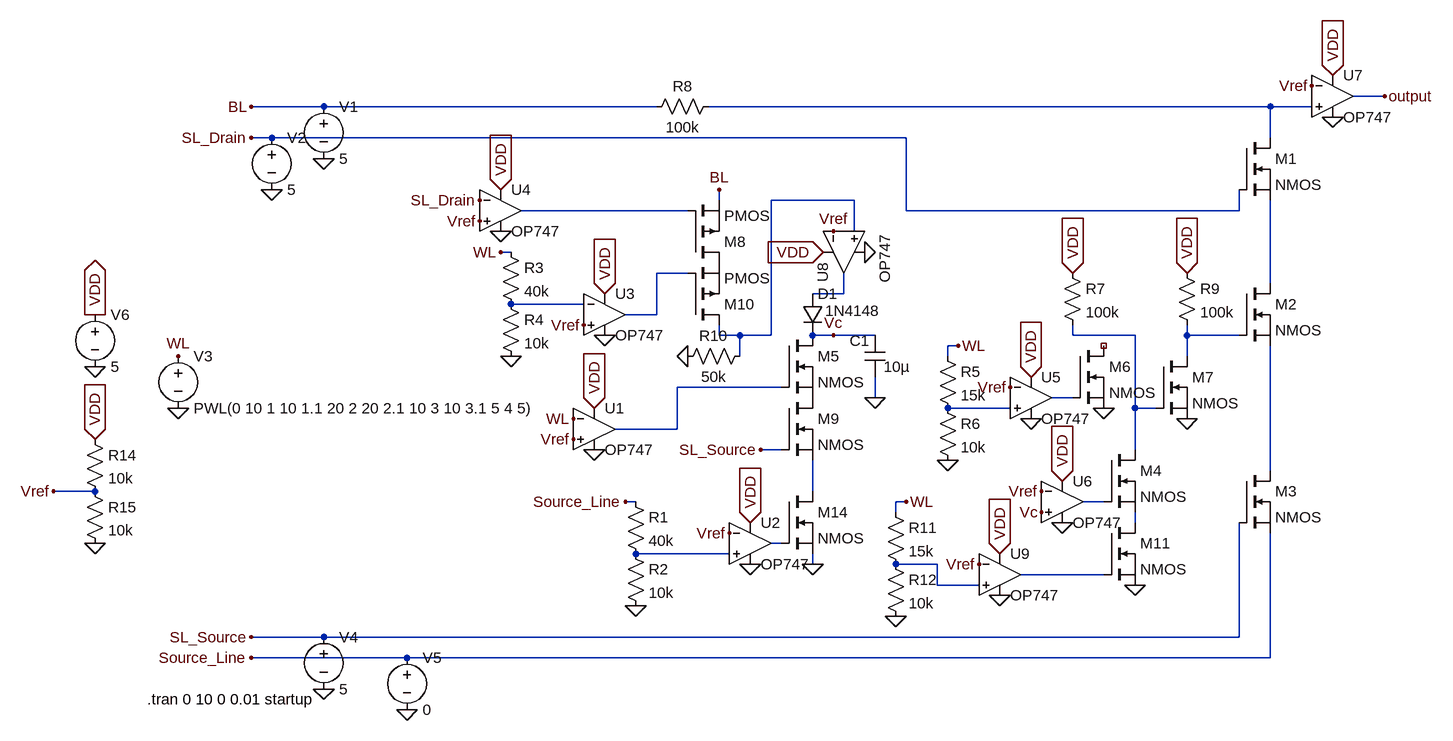
[diagram p0: schematic nand_test.asc]
nand_test.asc, the LTspice schematic file:
Version 4
SHEET 1 1904 1092
WIRE 1680 128 1632 128
WIRE 48 144 -64 144
WIRE 560 144 48 144
WIRE 1504 144 640 144
WIRE 1568 144 1504 144
WIRE -32 192 -64 192
WIRE 944 192 -32 192
WIRE 1504 192 1504 144
WIRE 656 288 656 272
WIRE 864 288 736 288
WIRE 608 304 352 304
WIRE 944 304 944 192
WIRE 1456 304 1456 272
WIRE 1456 304 944 304
WIRE 864 336 864 288
WIRE 336 368 320 368
WIRE 608 400 560 400
WIRE 1504 416 1504 288
WIRE 848 432 848 400
WIRE 848 432 800 432
WIRE 448 448 336 448
WIRE 560 464 560 400
WIRE 560 464 512 464
WIRE 656 496 656 480
WIRE 688 496 656 496
WIRE 736 496 736 288
WIRE 736 496 688 496
WIRE 832 496 800 496
WIRE 896 496 832 496
WIRE 1200 496 1200 480
WIRE 1296 496 1200 496
WIRE 1376 496 1376 480
WIRE 1456 496 1376 496
WIRE 1024 512 1008 512
WIRE 688 528 688 496
WIRE 1008 528 1008 512
WIRE 1376 528 1376 496
WIRE 752 576 592 576
WIRE 896 592 896 560
WIRE 1200 592 1168 592
WIRE 1104 608 1008 608
WIRE 1296 608 1296 496
WIRE 1328 608 1296 608
WIRE 592 640 592 576
WIRE 592 640 496 640
WIRE 752 672 720 672
WIRE 1296 672 1296 608
WIRE 1504 704 1504 512
WIRE -304 736 -368 736
WIRE 800 736 800 688
WIRE 528 752 512 752
WIRE 944 752 928 752
WIRE 1248 752 1216 752
WIRE 928 768 928 752
WIRE 1296 784 1296 768
WIRE 752 816 736 816
WIRE 672 832 528 832
WIRE 800 848 800 832
WIRE 992 848 928 848
WIRE 1248 864 1120 864
WIRE 992 880 992 848
WIRE 1056 880 992 880
WIRE 48 960 -64 960
WIRE 1456 960 1456 784
WIRE 1456 960 48 960
WIRE 176 992 -64 992
WIRE 1504 992 1504 800
WIRE 1504 992 176 992
FLAG 896 592 0
FLAG -64 144 BL
FLAG -176 528 WL
FLAG -64 192 SL_Drain
FLAG -64 960 SL_Source
FLAG -64 992 Source_Line
FLAG 48 224 0
FLAG -32 272 0
FLAG -176 608 0
FLAG 48 1040 0
FLAG 176 1072 0
FLAG -304 544 0
FLAG -304 464 VDD
IOPIN -304 464 Out
FLAG 1680 128 output
FLAG 832 496 Vc
FLAG 800 848 0
FLAG -304 816 0
FLAG -304 656 VDD
IOPIN -304 656 In
FLAG -368 736 Vref
FLAG 704 784 VDD
IOPIN 704 784 In
FLAG 704 848 0
FLAG 464 672 0
FLAG 480 432 VDD
IOPIN 480 432 In
FLAG 480 496 0
FLAG 720 672 SL_Source
FLAG 464 608 VDD
IOPIN 464 608 In
FLAG 320 272 VDD
IOPIN 320 272 In
FLAG 320 336 0
FLAG 288 320 Vref
FLAG 448 480 Vref
FLAG 672 800 Vref
FLAG 528 912 0
FLAG 512 752 Source_Line
FLAG 432 656 Vref
FLAG 432 624 WL
FLAG 336 528 0
FLAG 320 368 WL
FLAG 1136 560 VDD
IOPIN 1136 560 In
FLAG 1136 624 0
FLAG 1104 576 Vref
FLAG 1184 720 VDD
IOPIN 1184 720 In
FLAG 1184 784 0
FLAG 1152 736 Vref
FLAG 1152 768 Vc
FLAG 1008 688 0
FLAG 1024 512 WL
FLAG 1248 608 0
FLAG 1200 400 VDD
IOPIN 1200 400 In
FLAG 1376 400 VDD
IOPIN 1376 400 In
FLAG 1376 624 0
FLAG 1600 96 VDD
IOPIN 1600 96 In
FLAG 1600 160 0
FLAG 1568 112 Vref
FLAG 816 368 VDD
IOPIN 816 368 In
FLAG 880 368 0
FLAG 832 336 Vref
FLAG 608 528 0
FLAG 1296 880 0
FLAG 288 288 SL_Drain
FLAG 656 272 BL
FLAG 928 928 0
FLAG 944 752 WL
FLAG 1088 832 VDD
IOPIN 1088 832 In
FLAG 1088 896 0
FLAG 1056 848 Vref
SYMBOL nmos 1456 192 R0
SYMATTR InstName M1
SYMBOL nmos 1456 416 R0
SYMATTR InstName M2
SYMBOL cap 912 560 R180
WINDOW 0 24 56 Left 2
WINDOW 3 -38 16 Left 2
SYMATTR InstName C1
SYMATTR Value 10µ
SYMBOL nmos 1456 704 R0
SYMATTR InstName M3
SYMBOL nmos 752 496 R0
SYMATTR InstName M5
SYMBOL voltage 48 128 R0
WINDOW 123 0 0 Left 0
WINDOW 39 0 0 Left 0
SYMATTR InstName V1
SYMATTR Value 5
SYMBOL voltage -32 176 R0
WINDOW 123 0 0 Left 0
WINDOW 39 0 0 Left 0
SYMATTR InstName V2
SYMATTR Value 5
SYMBOL voltage -176 512 R0
WINDOW 123 0 0 Left 0
WINDOW 39 0 0 Left 0
SYMATTR InstName V3
SYMATTR Value PWL(0 10 1 10 1.1 20 2 20 2.1 10 3 10 3.1 5 4 5)
SYMBOL voltage 48 944 R0
WINDOW 123 0 0 Left 0
WINDOW 39 0 0 Left 0
SYMATTR InstName V4
SYMATTR Value 5
SYMBOL voltage 176 976 R0
WINDOW 123 0 0 Left 0
WINDOW 39 0 0 Left 0
SYMATTR InstName V5
SYMATTR Value 0
SYMBOL voltage -304 448 R0
WINDOW 123 0 0 Left 0
WINDOW 39 0 0 Left 0
SYMATTR InstName V6
SYMATTR Value 5
SYMBOL res 656 128 R90
WINDOW 0 0 56 VBottom 2
WINDOW 3 32 56 VTop 2
SYMATTR InstName R8
SYMATTR Value 100k
SYMBOL nmos 752 592 R0
SYMATTR InstName M9
SYMBOL nmos 752 736 R0
SYMATTR InstName M14
SYMBOL res -320 640 R0
SYMATTR InstName R14
SYMATTR Value 10k
SYMBOL res -320 720 R0
SYMATTR InstName R15
SYMATTR Value 10k
SYMBOL OpAmps\\OP747 464 576 R0
SYMATTR InstName U1
SYMBOL OpAmps\\OP747 704 752 R0
SYMATTR InstName U2
SYMBOL OpAmps\\OP747 480 400 R0
SYMATTR InstName U3
SYMBOL OpAmps\\OP747 320 240 R0
SYMATTR InstName U4
SYMBOL res 512 736 R0
SYMATTR InstName R1
SYMATTR Value 40k
SYMBOL res 512 816 R0
SYMATTR InstName R2
SYMATTR Value 10k
SYMBOL res 320 352 R0
SYMATTR InstName R3
SYMATTR Value 40k
SYMBOL res 320 432 R0
SYMATTR InstName R4
SYMATTR Value 10k
SYMBOL OpAmps\\OP747 1136 528 R0
SYMATTR InstName U5
SYMBOL OpAmps\\OP747 1184 688 R0
SYMATTR InstName U6
SYMBOL res 992 512 R0
SYMATTR InstName R5
SYMATTR Value 15k
SYMBOL res 992 592 R0
SYMATTR InstName R6
SYMATTR Value 10k
SYMBOL nmos 1248 672 R0
SYMATTR InstName M4
SYMBOL nmos 1200 512 R0
SYMATTR InstName M6
SYMBOL res 1184 384 R0
SYMATTR InstName R7
SYMATTR Value 100k
SYMBOL nmos 1328 528 R0
SYMATTR InstName M7
SYMBOL res 1360 384 R0
SYMATTR InstName R9
SYMATTR Value 100k
SYMBOL OpAmps\\OP747 1600 64 R0
SYMATTR InstName U7
SYMBOL pmos 608 384 M180
SYMATTR InstName M8
SYMBOL pmos 608 480 M180
SYMATTR InstName M10
SYMBOL OpAmps\\OP747 784 368 M90
WINDOW 3 -28 127 Left 2
SYMATTR InstName U8
SYMBOL res 704 512 R90
WINDOW 0 0 56 VBottom 2
WINDOW 3 32 56 VTop 2
SYMATTR InstName R10
SYMATTR Value 50k
SYMBOL diode 784 432 R0
WINDOW 3 35 26 Left 2
SYMATTR Value 1N4148
SYMATTR InstName D1
SYMBOL nmos 1248 784 R0
SYMATTR InstName M11
SYMBOL res 912 752 R0
SYMATTR InstName R11
SYMATTR Value 15k
SYMBOL res 912 832 R0
SYMATTR InstName R12
SYMATTR Value 10k
SYMBOL OpAmps\\OP747 1088 800 R0
SYMATTR InstName U9
TEXT -224 1056 Left 2 !.tran 0 10 0 0.01 startup

The netlist it stands for:
* nand_test.asc
M1 N001 SL_Drain N005 N005 NMOS
M2 N005 N009 N013 N013 NMOS
C1 0 Vc 10µ
M3 N013 SL_Source Source_Line Source_Line NMOS
M5 Vc N010 P001 P001 NMOS
V1 BL 0 5
V2 SL_Drain 0 5
V3 WL 0 PWL(0 10 1 10 1.1 20 2 20 2.1 10 3 10 3.1 5 4 5)
V4 SL_Source 0 5
V5 Source_Line 0 0
V6 VDD 0 5
R8 N001 BL 100k
M9 P001 SL_Source N014 N014 NMOS
M14 N014 N017 0 0 NMOS
R14 VDD Vref 10k
R15 Vref 0 10k
XU1 Vref WL VDD 0 N010 OP747  ; pins In+ In- V+ V- OUT
XU2 N018 Vref VDD 0 N017 OP747  ; pins In+ In- V+ V- OUT
XU3 Vref N007 VDD 0 N004 OP747  ; pins In+ In- V+ V- OUT
XU4 Vref SL_Drain VDD 0 N003 OP747  ; pins In+ In- V+ V- OUT
R1 Source_Line N018 40k
R2 N018 0 10k
R3 WL N007 40k
R4 N007 0 10k
XU5 N012 Vref VDD 0 N011 OP747  ; pins In+ In- V+ V- OUT
XU6 Vc Vref VDD 0 N015 OP747  ; pins In+ In- V+ V- OUT
R5 WL N012 15k
R6 N012 0 10k
M4 N008 N015 N016 N016 NMOS
M6 NC_01 N011 0 0 NMOS
R7 VDD N008 100k
M7 N009 N008 0 0 NMOS
R9 VDD N009 100k
XU7 N001 Vref VDD 0 output OP747  ; pins In+ In- V+ V- OUT
M8 P002 N003 BL BL PMOS
M10 N002 N004 P002 P002 PMOS
XU8 N002 Vref VDD 0 N006 OP747  ; pins In+ In- V+ V- OUT
R10 N002 0 50k
D1 N006 Vc 1N4148
M11 N016 N020 0 0 NMOS
R11 WL N019 15k
R12 N019 0 10k
XU9 N019 Vref VDD 0 N020 OP747  ; pins In+ In- V+ V- OUT
.model D D
.lib standard.dio
.model NMOS NMOS
.model PMOS PMOS
.lib standard.mos
.tran 0 10 0 0.01 startup
.backanno
.end

* Results of the author's LTspice run, read from the files saved beside the schematic
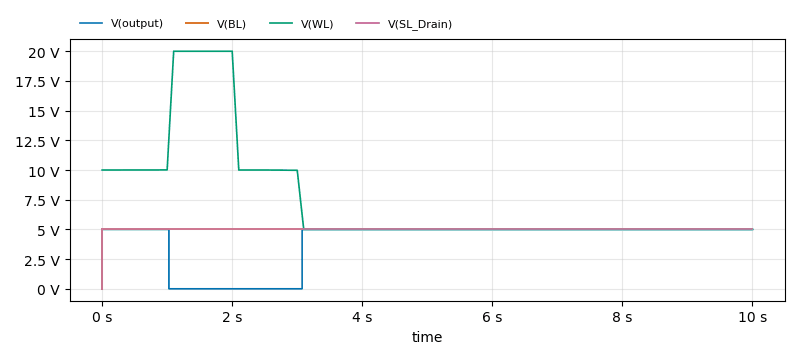
[diagram p1: Transient Analysis of nand_test.asc, plotted from the saved traces]
* Transient Analysis, 1 run:
*   V(output): min -2.902 mV, max 5.005 V, average 3.976 V, rms 4.459 V, last 5 V
*   V(BL): min 0 V, max 5 V, average 5 V, rms 5 V, last 5 V
*   V(WL): min 5 V, max 20 V, average 7.524 V, rms 8.804 V, last 5 V
*   V(SL_Drain): min 0 V, max 5 V, average 5 V, rms 5 V, last 5 V